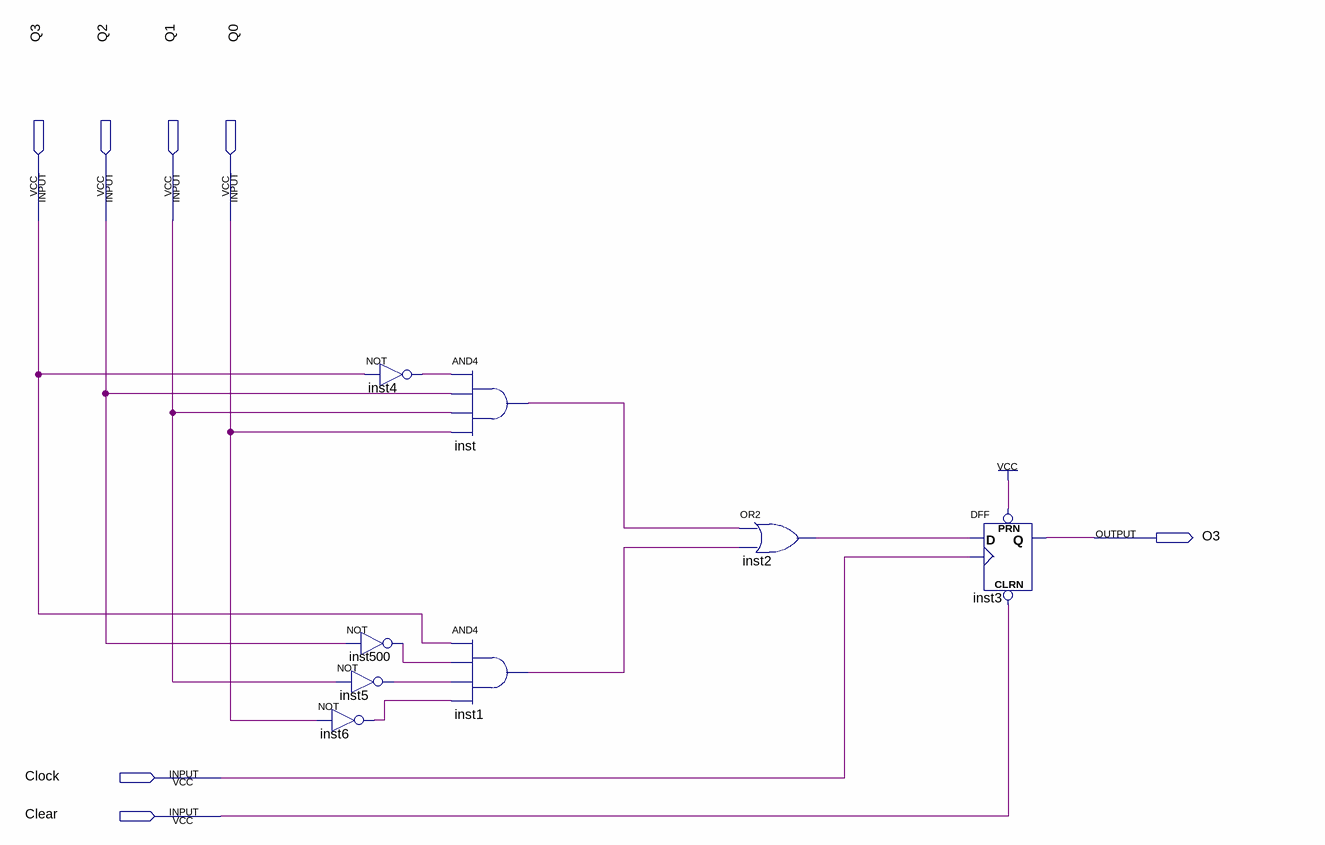
[diagram p0: schematic sheet]
// Quartus schematic 09D3.bdf as structural Verilog: 8 symbols, 7 pins
module \09D3  (
  input  Q3,
  input  Q2,
  input  Q1,
  input  Q0,
  input  Clock,
  input  Clear,
  output O3
);

  wire inst1_out, inst2_out, inst4_out, inst5_out, inst6_out, inst500_out, inst_out;

  not inst6 (inst6_out, Q0);
  not inst4 (inst4_out, Q3);
  not inst500 (inst500_out, Q2);
  not inst5 (inst5_out, Q1);
  and inst (inst_out, inst4_out, Q2, Q1, Q0);
  and inst1 (inst1_out, Q3, inst500_out, inst5_out, inst6_out);
  or inst2 (inst2_out, inst_out, inst1_out);
  DFF inst3 (.CLRN(Clear), .CLK(Clock), .D(inst2_out), .PRN(1'b1), .Q(O3));
endmodule
